# Altium schematic sheet Power.SchDoc
size Letter
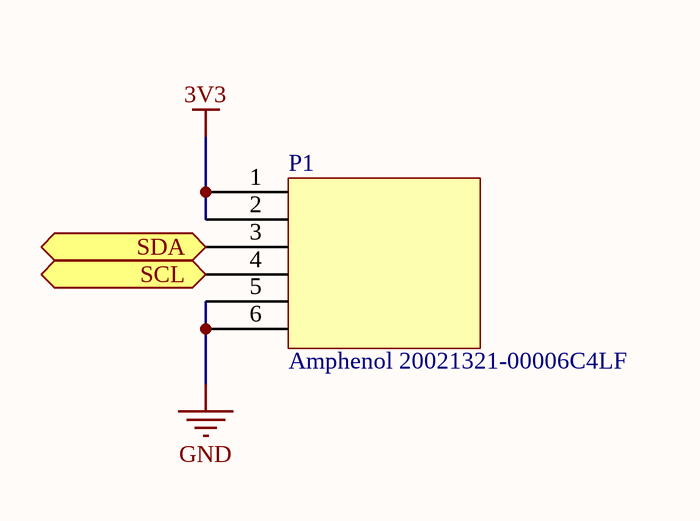
[diagram p0: Power.SchDoc]

## Parts
P1  Amphenol 20021321-00006C4LF  [Amphenol FCI 20021321-00006C4LF - duplicate]

## Ports
SCL (bidir), SDA (bidir)

## Nets
3V3: P1.1 P1.2
GND: P1.5 P1.6
SCL: P1.4 ; port SCL
SDA: P1.3 ; port SDA

## Library data of the parts
P1 = Amphenol FCI 20021321-00006C4LF: 6 Position Receptacle Connector 0.050" (1.27mm) Surface Mount Gold; Manufacturer 1: Amphenol FCI; Manufacturer Part Number 1: 20021321-00006C4LF; Supplier 1: Digi-Key; Supplier Part Number 1: 609-3704-1-ND; ComponentLink1URL: *; ComponentLink1URL: https://www.digikey.com/product-detail/en/amphenol-fci/20021321-00006C4LF/609-3704-1-ND/2209148; ComponentLink1Description: Website